# EAGLE schematic etapa 4444 (EAGLE 7.5.0)
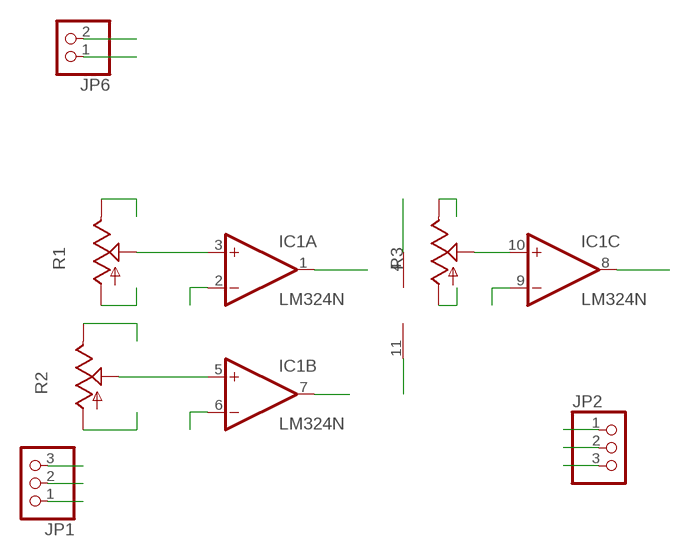
[diagram p0: schematic, sheet 1]

## Parts
IC1  LM324N  [DIL14]
JP1  PINHD-1X3  [1X03]
JP2  PINHD-1X3  [1X03]
JP6  PINHD-1X2  [1X02]
R1  TRIM_US-S64W  [S64W]
R2  TRIM_US-S64W  [S64W]
R3  TRIM_US-S64W  [S64W]

## Nets
FIL1: IC1.2(A:-IN) JP1.2
FIL2: IC1.6(B:-IN) JP1.3
FIL3: IC1.9(C:-IN) JP1.1
GND: IC1.11(P:V-) JP6.1 R1.A R2.A R3.A
N$9: IC1.5(B:+IN) R2.S
N$12: IC1.3(A:+IN) R1.S
N$15: IC1.10(C:+IN) R3.S
OFIL1: IC1.1(A:OUT) JP2.1
OFIL2: IC1.7(B:OUT) JP2.2
OFIL3: IC1.8(C:OUT) JP2.3
VCC: IC1.4(P:V+) JP6.2 R1.E R2.E R3.E
Unconnected: IC1.12(D:+IN) IC1.13(D:-IN) IC1.14(D:OUT)

## Library data of the parts
IC1 = linear:LM324: OP AMP
JP1 JP2 = pinhead:PINHD-1X3: PIN HEADER
JP6 = pinhead:PINHD-1X2: PIN HEADER
R1-R3 = pot:TRIM_US-: POTENTIOMETER